# Altium schematic sheet minireg-lt8410.SchDoc
size A4; SheetNumber: 1; SheetTotal: 1
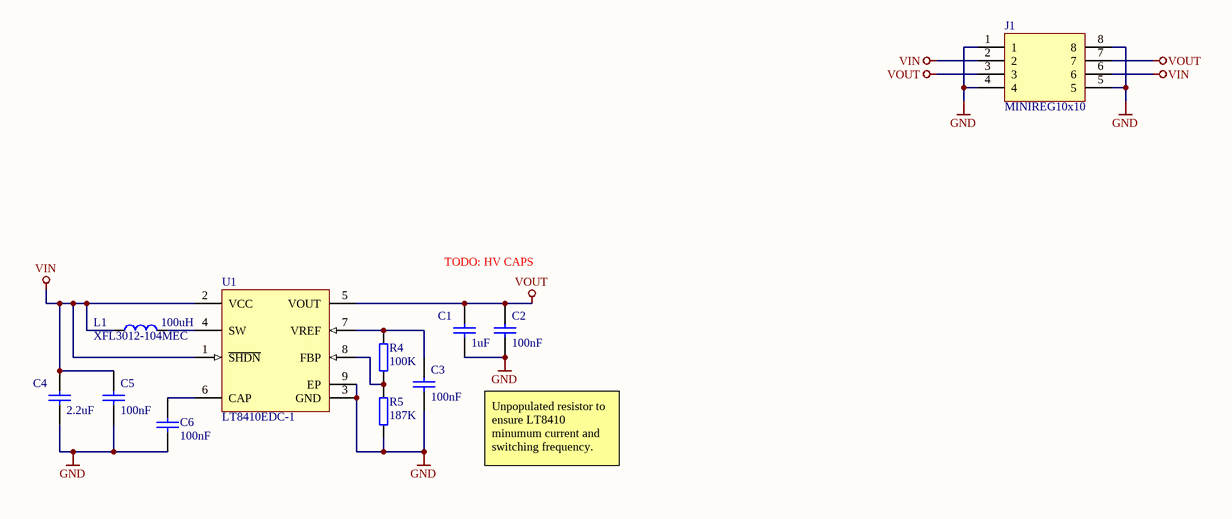
[diagram p0: minireg-lt8410.SchDoc]

## Parts
C1  value 1uF  [CAP0603]  (hidden comment: CAP)
C2  value 100nF  [CAP0603]  (hidden comment: CAP)
C3  value 100nF  [CAP0603]  (hidden comment: CAP)
C4  value 2.2uF  [CAP0603]  (hidden comment: CAP)
C5  value 100nF  [CAP0603]  (hidden comment: CAP)
C6  value 100nF  [CAP0603]  (hidden comment: CAP)
J1  MINIREG10x10  [MINIREG8_10x10R]
L1  XFL3012-104MEC  value 100uH  [XFL3012]
R4  value 100K  [RES0603]  (hidden comment: RES)
R5  value 187K  [RES0603]  (hidden comment: RES)
U1  LT8410EDC-1  [LT8410]

## Nets
GND: C1.1 C2.1 C3.1 C4.1 C5.1 C6.1 J1.1 J1.4 J1.5 J1.8 R5.1 U1.3(GND) U1.9(EP)
VIN: C4.2 C5.2 J1.2 J1.6 L1.1 U1.1(~{SHDN}) U1.2(VCC)
VOUT: C1.2 C2.2 J1.3 J1.7 U1.5(VOUT)
NetC3_2: C3.2 R4.2 U1.7(VREF)
NetC6_2: C6.2 U1.6(CAP)
NetL1_2: L1.2 U1.4(SW)
NetR4_1: R4.1 R5.2 U1.8(FBP)

## Notes on the sheet
- TODO: HV CAPS
- Unpopulated resistor to ensure LT8410 minumum current and switching frequency.

## Library data of the parts
C1 = CAP-SM-0603-X7R-1uF: CAP SM 0603 X7R 1uF; Manufacturer: GENERIC; Part Number: CAP-SM-0603-X7R-1uF; Package: 0603
C2 C3 C5 C6 = CAP-SM-0603-X7R-100nF: CAP SM 0603 X7R 100nF; Manufacturer: GENERIC; Part Number: CAP-SM-0603-X7R-100nF; Package: 0603
C4 = CAP-SM-0603-X5R-2.2uF: CAP SM 0603 X5R 2.2uF; Manufacturer: GENERIC; Part Number: CAP-SM-0603-X5R-2.2uF; Package: 0603
L1 = XFL3012-104MEC: IND SM 100uH 290mA 3Ohm 1212 3x3mm
R4 = RES-SM-0603-100K: RES SM 0603 100K; Manufacturer: GENERIC; Part Number: RES-SM-0603-100K; Package: 0603
R5 = RES-SM-0603-187K: RES SM 0603 187K; Manufacturer: GENERIC; Part Number: RES-SM-0603-187K; Package: 0603
U1 = LT8410: Ultralow Power Boost Converter with Output Disconnect, 8-pin SON (DC8), -40 to 125 degC, Pb-Free, Mini Tape and Reel; Manufacturer: Linear Technology; PartNumber: LT8410EDC-1#TRMPBF; Number of Outputs: 1; PackageReference: DC8; PackageDescription: 8-Pin Plastic DFN, Body 2 x 2 mm, Pitch 0.45 mm; ComponentLink1Description: Manufacturer URL; PackageVersion: Rev. A, 04/2009; ComponentLink3URL: http://cds.linear.com/docs/en/packaging/DFN_8_05-08-1719.pdf; RoHS: TRUE; ComponentLink3Description: Package Specification; DatasheetVersion: Rev. B; ComponentLink1URL: http://www.linear.com/; ComponentLink2URL: http://cds.linear.com/docs/en/datasheet/84101fb.pdf; Mounting Technology: Surface Mount; Packing: Mini Tape and Reel; ComponentLink2Description: Datasheet